# EAGLE board arca-2.0 (EAGLE 9.6.2)
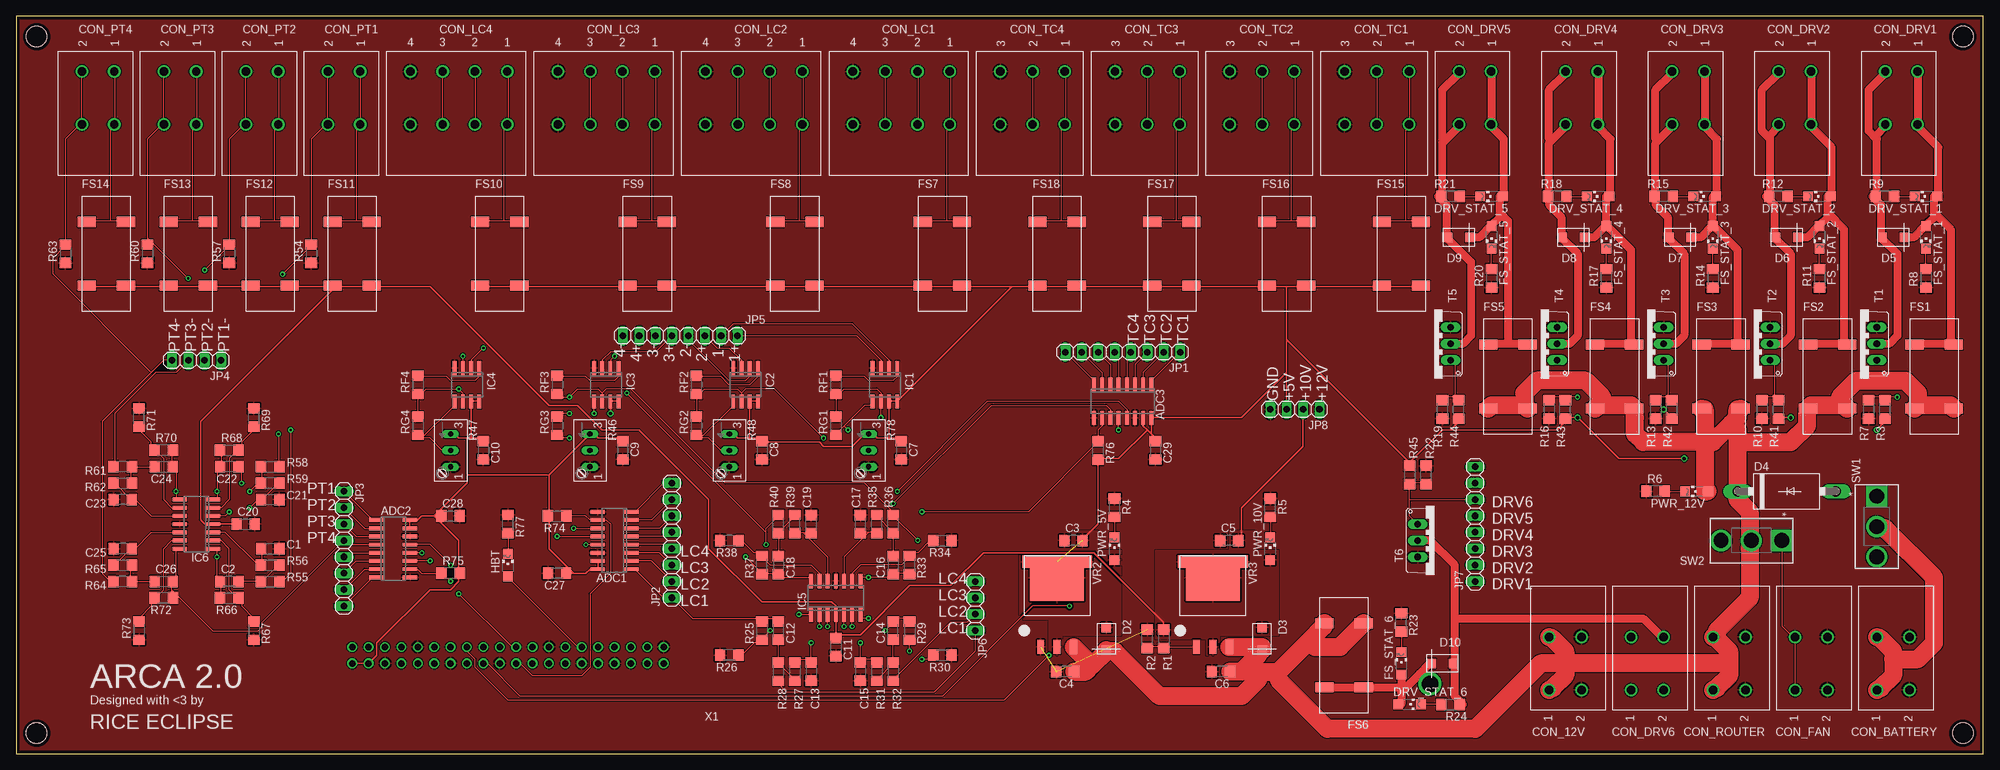
[diagram p8: board, top side]
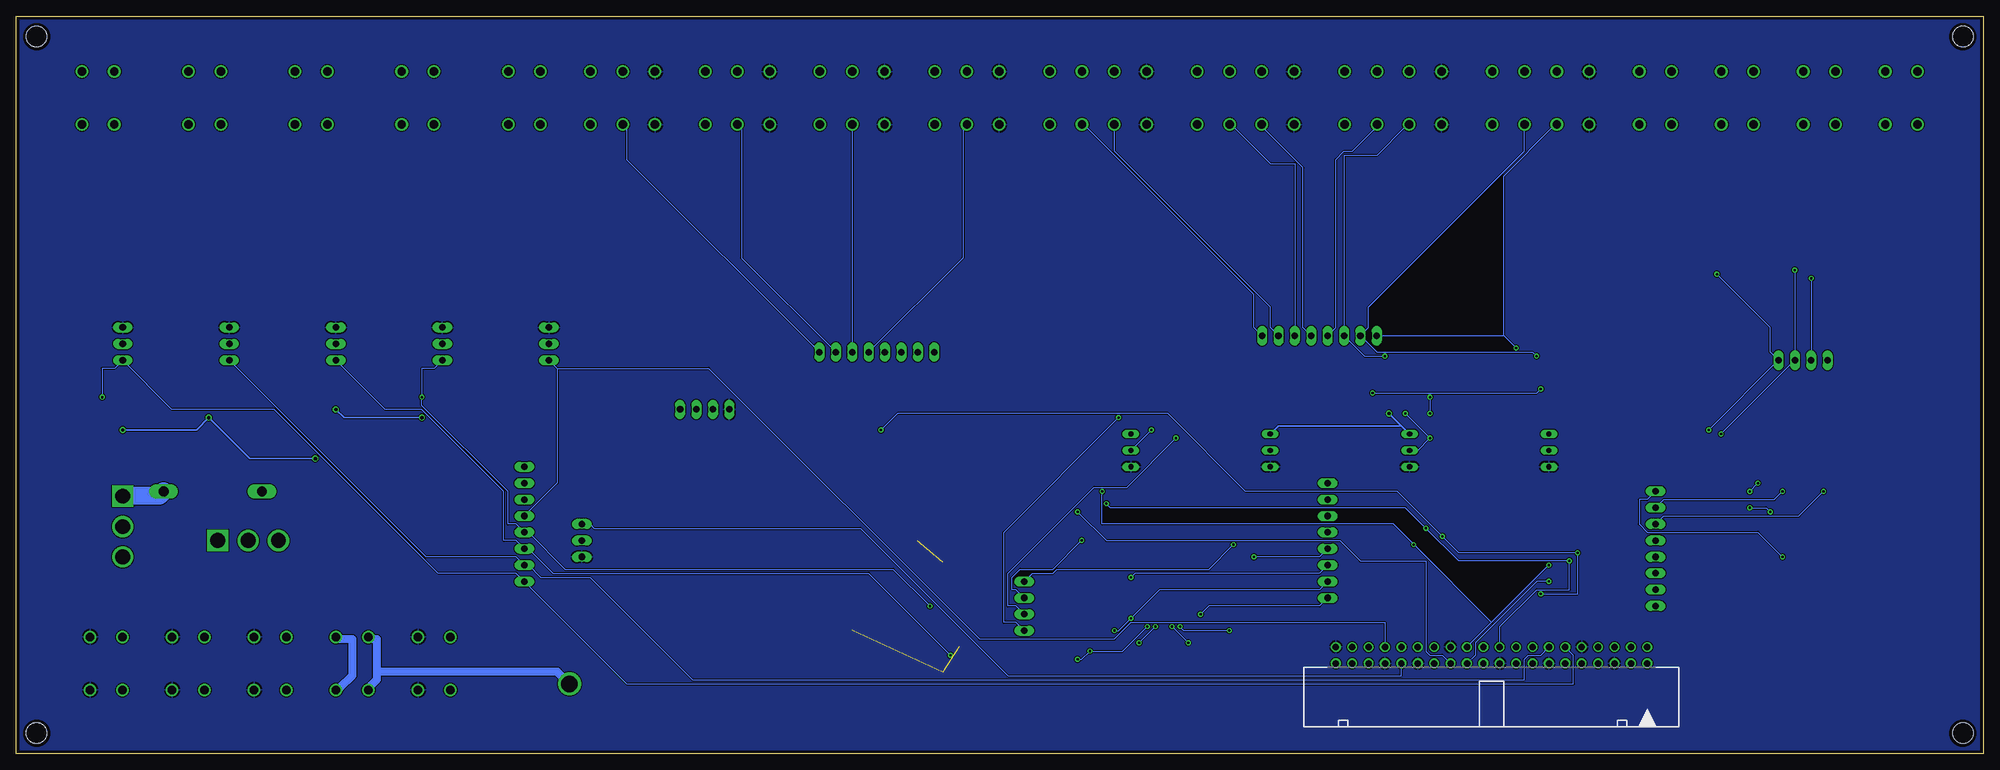
[diagram p9: board, bottom side, seen from below]

Size 304.8 x 114.3 mm. Coordinates in mm from the lower left corner, seen from the top.
Outline: 0,0 304.8,0 304.8,114.3 0,114.3 0,0
Copper layers (1*16): Top 0.035mm / dielectric 1.5mm / Bottom 0.035mm
Design rules "default *": minimum track width 6mil, minimum drill 0.35mm, track to track 6mil, track to pad 6mil, pad to pad 6mil, via to via 6mil, smd to smd 6mil, copper to edge 20mil, drill to drill 6mil, minimum pad ring 10mil, minimum via ring 8mil, stop-mask expansion 4mil, vias tented up to drill 0mil, thermal gap 10mil
Net classes: 1 12V: width 2.794 mm, drill 5.08 mm, clearance 0.508 mm; 2 Driver: width 1.27 mm, drill 2.54 mm, clearance 0.254 mm; 3 5V: width 0.254 mm, drill 0.508 mm, clearance 0.254 mm; 5 10V: width 0.254 mm, drill 0.508 mm, clearance 0.254 mm
Holes 3.17 mm at 3.17,3.17 301.62,3.17 301.62,111.12 3.17,111.12

## Footprints (pad centres in the part's own frame; a part is rotated, then mirrored left to right if it is on the bottom)
SO-16 = smd 0.6 x 2.2: 1 -4.445,-2.6; 2 -3.175,-2.6; 3 -1.905,-2.6; 4 -0.635,-2.6; 5 0.635,-2.6; 6 1.905,-2.6; 7 3.175,-2.6; 8 4.445,-2.6; 9 4.445,2.6; 10 3.175,2.6; 11 1.905,2.6; 12 0.635,2.6; 13 -0.635,2.6; 14 -1.905,2.6; 15 -3.175,2.6; 16 -4.445,2.6
C1206 = smd 1.6 x 1.8: 1 -1.4,0; 2 1.4,0
8.2X2 = drill 1.3: 1 -4.1,2.5; 2 4.1,2.5; 3 -4.1,-2.5; 4 4.1,-2.5
8.2X4 = drill 1.3: 1 -4.1,7.5; 2 4.1,7.5; 3 -4.1,2.5; 4 4.1,2.5; 5 -4.1,-2.5; 6 4.1,-2.5; 7 -4.1,-7.5; 8 4.1,-7.5
8.2X3 = drill 1.3: 1 -4.1,5; 2 4.1,5; 3 -4.1,0; 4 4.1,0; 5 -4.1,-5; 6 4.1,-5
SS* = smd 1.5 x 1.5: P$1 1.75,0; P$2 -1.75,0
DO201-15 = drill 1.499 long: A 7.62,0; C -7.62,0
CHIPLED_1206 = smd 1.5 x 1.5: A 0,-1.75; C 0,1.75
3588-20 = smd 1.575 x 2.819: P$1 -4.953,3.035; P$2 -4.953,-3.035; P$3 4.953,3.035; P$4 4.953,-3.035
SO-8 = smd 0.6 x 2.2: 1 -1.905,-2.6; 2 -0.635,-2.6; 3 0.635,-2.6; 4 1.905,-2.6; 5 1.905,2.6; 6 0.635,2.6; 7 -0.635,2.6; 8 -1.905,2.6
SO14 = smd 0.6 x 2.2: 1 -3.81,-2.6; 2 -2.54,-2.6; 3 -1.27,-2.6; 4 0,-2.6; 5 1.27,-2.6; 6 2.54,-2.6; 7 3.81,-2.6; 8 3.81,2.6; 9 2.54,2.6; 10 1.27,2.6; 11 0,2.6; 12 -1.27,2.6; 13 -2.54,2.6; 14 -3.81,2.6
1X08 = drill 1.016 long: 1 -8.89,0; 2 -6.35,0; 3 -3.81,0; 4 -1.27,0; 5 1.27,0; 6 3.81,0; 7 6.35,0; 8 8.89,0
1X04 = drill 1.016 long: 1 -3.81,0; 2 -1.27,0; 3 1.27,0; 4 3.81,0
R1206 = smd 1.6 x 1.803: 1 -1.422,0; 2 1.422,0
S64W = drill 0.813 long: A 2.54,1.27; E -2.54,1.27; S 0,1.27
1101M2S3CQE2 = drill 2.286 pad 2.794 square: 1 0,9.398 | drill 2.286 pad 2.794: 2 0,4.699; 3 0,0
TO220V = drill 1.016 long: 1 -2.54,-2.54; 2 0,-2.54; 3 2.54,-2.54
TO-263-3L = smd 2.159 x 1.067: P$1 0,-2.54; P$2 0,0; P$3 0,2.54 | smd 6.985 x 8.331: P$4 -10.681,0 | smd 1.905 x 10.795: P$5 -13.221,0
PAK100/2500-5-40 = drill 1 pad 1.422: 1 -24.13,-1.27; 2 -24.13,1.27; 3 -21.59,-1.27; 4 -21.59,1.27; 5 -19.05,-1.27; 6 -19.05,1.27; 7 -16.51,-1.27; 8 -16.51,1.27; 9 -13.97,-1.27; 10 -13.97,1.27; 11 -11.43,-1.27; 12 -11.43,1.27; 13 -8.89,-1.27; 14 -8.89,1.27; 15 -6.35,-1.27; 16 -6.35,1.27; 17 -3.81,-1.27; 18 -3.81,1.27; 19 -1.27,-1.27; 20 -1.27,1.27; 21 1.27,-1.27; 22 1.27,1.27; 23 3.81,-1.27; 24 3.81,1.27; 25 6.35,-1.27; 26 6.35,1.27; 27 8.89,-1.27; 28 8.89,1.27; 29 11.43,-1.27; 30 11.43,1.27; 31 13.97,-1.27; 32 13.97,1.27; 33 16.51,-1.27; 34 16.51,1.27; 35 19.05,-1.27; 36 19.05,1.27; 37 21.59,-1.27; 38 21.59,1.27; 39 24.13,-1.27; 40 24.13,1.27

## Placement (x,y rotation side)
ADC1  MCP3208SN  [SO-16]  92.71,33.02 90 top
ADC2  MCP3208SN  [SO-16]  58.42,31.75 270 top
ADC3  MCP3208SN  [SO-16]  171.45,54.61 180 top
C1  1n  [C1206]  39.37,31.75 0 top
C2  1n  [C1206]  33.02,26.67 180 top
C3  10u  [C1206]  163.83,33.02 180 top
C4  10u  [C1206]  162.56,12.7 180 top
C5  10u  [C1206]  187.96,33.02 180 top
C6  10u  [C1206]  186.69,12.7 180 top
C7  1u  [C1206]  137.16,46.99 270 top
C8  1u  [C1206]  115.57,46.99 270 top
C9  1u  [C1206]  93.98,46.99 270 top
C10  1u  [C1206]  72.39,46.99 270 top
C11  100n  [C1206]  127,16.51 270 top
C12  1n  [C1206]  118.11,19.05 90 top
C13  1n  [C1206]  123.19,12.7 270 top
C14  1n  [C1206]  135.89,19.05 90 top
C15  1n  [C1206]  130.81,12.7 270 top
C16  1n  [C1206]  135.89,29.21 270 top
C17  1n  [C1206]  130.81,35.56 90 top
C18  1n  [C1206]  118.11,29.21 270 top
C19  1n  [C1206]  123.19,35.56 90 top
C20  100n  [C1206]  35.56,35.56 0 top
C21  1n  [C1206]  39.37,39.37 0 top
C22  1n  [C1206]  33.02,44.45 180 top
C23  1n  [C1206]  16.51,39.37 180 top
C24  1n  [C1206]  22.86,44.45 0 top
C25  1n  [C1206]  16.51,31.75 180 top
C26  1n  [C1206]  22.86,26.67 0 top
C27  100n  [C1206]  83.82,27.94 180 top
C28  100n  [C1206]  67.31,36.83 0 top
C29  100n  [C1206]  176.53,46.99 270 top
CON_12V  LPTA-2POS  [8.2X2]  240.03,13.97 90 top
CON_BATTERY  LPTA-2POS  [8.2X2]  290.83,13.97 90 top
CON_DRV1  LPTA-2POS  [8.2X2]  292.1,101.6 270 top
CON_DRV2  LPTA-2POS  [8.2X2]  275.59,101.6 270 top
CON_DRV3  LPTA-2POS  [8.2X2]  259.08,101.6 270 top
CON_DRV4  LPTA-2POS  [8.2X2]  242.57,101.6 270 top
CON_DRV5  LPTA-2POS  [8.2X2]  226.06,101.6 270 top
CON_DRV6  LPTA-2POS  [8.2X2]  252.73,13.97 90 top
CON_FAN  LPTA-2POS  [8.2X2]  278.13,13.97 90 top
CON_LC1  LPTA-4POS  [8.2X4]  137.16,101.6 270 top
CON_LC2  LPTA-4POS  [8.2X4]  114.3,101.6 270 top
CON_LC3  LPTA-4POS  [8.2X4]  91.44,101.6 270 top
CON_LC4  LPTA-4POS  [8.2X4]  68.58,101.6 270 top
CON_PT1  LPTA-2POS  [8.2X2]  50.8,101.6 270 top
CON_PT2  LPTA-2POS  [8.2X2]  38.1,101.6 270 top
CON_PT3  LPTA-2POS  [8.2X2]  25.4,101.6 270 top
CON_PT4  LPTA-2POS  [8.2X2]  12.7,101.6 270 top
CON_ROUTER  LPTA-2POS  [8.2X2]  265.43,13.97 90 top
CON_TC1  LPTA-3POS  [8.2X3]  210.82,101.6 270 top
CON_TC2  LPTA-3POS  [8.2X3]  193.04,101.6 270 top
CON_TC3  LPTA-3POS  [8.2X3]  175.26,101.6 270 top
CON_TC4  LPTA-3POS  [8.2X3]  157.48,101.6 270 top
D2  SS54  [SS*]  168.91,17.78 270 top
D3  SS54  [SS*]  193.04,17.78 270 top
D4  [DO201-15]  274.32,40.64 0 top
D5  SS54  [SS*]  290.83,80.01 0 top
D6  SS54  [SS*]  274.32,80.01 0 top
D7  SS54  [SS*]  257.81,80.01 0 top
D8  SS54  [SS*]  241.3,80.01 0 top
D9  SS54  [SS*]  223.52,80.01 0 top
D10  SS54  [SS*]  220.98,13.97 180 top
DRV_STAT_1  YLW  [CHIPLED_1206]  295.91,86.36 90 top
DRV_STAT_2  YLW  [CHIPLED_1206]  279.4,86.36 90 top
DRV_STAT_3  YLW  [CHIPLED_1206]  261.62,86.36 90 top
DRV_STAT_4  YLW  [CHIPLED_1206]  245.11,86.36 90 top
DRV_STAT_5  YLW  [CHIPLED_1206]  228.6,86.36 90 top
DRV_STAT_6  YLW  [CHIPLED_1206]  215.9,7.62 270 top
FS1  HOLDER_3588-20  [3588-20]  297.18,58.42 270 top
FS2  HOLDER_3588-20  [3588-20]  280.67,58.42 270 top
FS3  HOLDER_3588-20  [3588-20]  264.16,58.42 270 top
FS4  HOLDER_3588-20  [3588-20]  247.65,58.42 270 top
FS5  HOLDER_3588-20  [3588-20]  231.14,58.42 270 top
FS6  HOLDER_3588-20  [3588-20]  205.74,15.24 90 top
FS7  HOLDER_3588-20  [3588-20]  143.51,77.47 270 top
FS8  HOLDER_3588-20  [3588-20]  120.65,77.47 270 top
FS9  HOLDER_3588-20  [3588-20]  97.79,77.47 270 top
FS10  HOLDER_3588-20  [3588-20]  74.93,77.47 270 top
FS11  HOLDER_3588-20  [3588-20]  52.07,77.47 270 top
FS12  HOLDER_3588-20  [3588-20]  39.37,77.47 270 top
FS13  HOLDER_3588-20  [3588-20]  26.67,77.47 270 top
FS14  HOLDER_3588-20  [3588-20]  13.97,77.47 270 top
FS15  HOLDER_3588-20  [3588-20]  214.63,77.47 270 top
FS16  HOLDER_3588-20  [3588-20]  196.85,77.47 270 top
FS17  HOLDER_3588-20  [3588-20]  179.07,77.47 270 top
FS18  HOLDER_3588-20  [3588-20]  161.29,77.47 270 top
FS_STAT_1  BLU  [CHIPLED_1206]  295.91,80.01 180 top
FS_STAT_2  BLU  [CHIPLED_1206]  279.4,80.01 180 top
FS_STAT_3  BLU  [CHIPLED_1206]  262.89,80.01 180 top
FS_STAT_4  BLU  [CHIPLED_1206]  246.38,80.01 180 top
FS_STAT_5  BLU  [CHIPLED_1206]  228.6,80.01 180 top
FS_STAT_6  BLU  [CHIPLED_1206]  214.63,13.97 0 top
HBT  BLU  [CHIPLED_1206]  76.2,29.21 0 top
IC1  MCP6N11R  [SO-8]  134.62,57.15 180 top
IC2  MCP6N11R  [SO-8]  113.03,57.15 180 top
IC3  MCP6N11R  [SO-8]  91.44,57.15 180 top
IC4  MCP6N11R  [SO-8]  69.85,57.15 180 top
IC5  LM324D  [SO14]  127,24.13 0 top
IC6  LM324D  [SO14]  27.94,35.56 90 top
JP1  [1X08]  171.45,62.23 180 top
JP2  [1X08]  101.6,33.02 90 top
JP3  [1X08]  50.8,31.75 270 top
JP4  [1X04]  27.94,60.96 180 top
JP5  [1X08]  102.87,64.77 180 top
JP6  [1X04]  148.59,22.86 90 top
JP7  [1X08]  226.06,35.56 90 top
JP8  [1X04]  198.12,53.34 180 top
PWR_5V  RED  [CHIPLED_1206]  170.18,31.75 0 top
PWR_10V  RED  [CHIPLED_1206]  194.31,31.75 0 top
PWR_12V  RED  [CHIPLED_1206]  260.35,40.64 90 top
R1  68k  [R1206]  177.8,17.78 90 top
R2  10k  [R1206]  175.26,17.78 270 top
R3  DNP  [R1206]  289.56,53.34 270 top
R4  68  [R1206]  170.18,38.1 270 top
R5  220  [R1206]  194.31,38.1 270 top
R6  300  [R1206]  254,40.64 0 top
R7  10k  [R1206]  287.02,53.34 90 top
R8  220  [R1206]  295.91,73.66 90 top
R9  220  [R1206]  289.56,86.36 0 top
R10  10k  [R1206]  270.51,53.34 90 top
R11  220  [R1206]  279.4,73.66 90 top
R12  220  [R1206]  273.05,86.36 0 top
R13  10k  [R1206]  254,53.34 90 top
R14  220  [R1206]  262.89,73.66 90 top
R15  220  [R1206]  255.27,86.36 0 top
R16  10k  [R1206]  237.49,53.34 90 top
R17  220  [R1206]  246.38,73.66 90 top
R18  220  [R1206]  238.76,86.36 0 top
R19  10k  [R1206]  220.98,53.34 90 top
R20  220  [R1206]  228.6,73.66 90 top
R21  220  [R1206]  222.25,86.36 0 top
R22  10k  [R1206]  218.44,43.18 270 top
R23  220  [R1206]  214.63,20.32 270 top
R24  220  [R1206]  222.25,7.62 180 top
R25  15k  [R1206]  115.57,19.05 90 top
R26  10k  [R1206]  110.49,15.24 0 top
R27  68k  [R1206]  120.65,12.7 90 top
R28  68k  [R1206]  118.11,12.7 90 top
R29  15k  [R1206]  138.43,19.05 90 top
R30  10k  [R1206]  143.51,15.24 180 top
R31  68k  [R1206]  133.35,12.7 90 top
R32  68k  [R1206]  135.89,12.7 90 top
R33  15k  [R1206]  138.43,29.21 270 top
R34  10k  [R1206]  143.51,33.02 180 top
R35  68k  [R1206]  133.35,35.56 270 top
R36  68k  [R1206]  135.89,35.56 270 top
R37  15k  [R1206]  115.57,29.21 270 top
R38  10k  [R1206]  110.49,33.02 0 top
R39  68k  [R1206]  120.65,35.56 270 top
R40  68k  [R1206]  118.11,35.56 270 top
R41  DNP  [R1206]  273.05,53.34 270 top
R42  DNP  [R1206]  256.54,53.34 270 top
R43  DNP  [R1206]  240.03,53.34 270 top
R44  DNP  [R1206]  223.52,53.34 270 top
R45  DNP  [R1206]  215.9,43.18 90 top
R46  [S64W]  87.63,46.99 270 top
R47  [S64W]  66.04,46.99 270 top
R48  [S64W]  109.22,46.99 270 top
R54  22  [R1206]  45.72,77.47 90 top
R55  68k  [R1206]  39.37,26.67 180 top
R56  68k  [R1206]  39.37,29.21 180 top
R57  22  [R1206]  33.02,77.47 90 top
R58  68k  [R1206]  39.37,44.45 180 top
R59  68k  [R1206]  39.37,41.91 0 top
R60  22  [R1206]  20.32,77.47 90 top
R61  68k  [R1206]  16.51,44.45 0 top
R62  68k  [R1206]  16.51,41.91 180 top
R63  22  [R1206]  7.62,77.47 90 top
R64  68k  [R1206]  16.51,26.67 0 top
R65  68k  [R1206]  16.51,29.21 180 top
R66  47k  [R1206]  33.02,24.13 180 top
R67  5.1k  [R1206]  36.83,19.05 90 top
R68  47k  [R1206]  33.02,46.99 180 top
R69  5.1k  [R1206]  36.83,52.07 270 top
R70  47k  [R1206]  22.86,46.99 0 top
R71  5.1k  [R1206]  19.05,52.07 270 top
R72  47k  [R1206]  22.86,24.13 0 top
R73  5.1k  [R1206]  19.05,19.05 90 top
R74  10k  [R1206]  83.82,36.83 180 top
R75  10k  [R1206]  67.31,27.94 0 top
R76  10k  [R1206]  167.64,46.99 270 top
R77  68  [R1206]  76.2,35.56 270 top
R78  30k  [S64W]  130.81,46.99 270 top
RF1  20k  [R1206]  127,57.15 90 top
RF2  20k  [R1206]  105.41,57.15 90 top
RF3  20k  [R1206]  83.82,57.15 90 top
RF4  20k  [R1206]  62.23,57.15 90 top
RG1  200  [R1206]  127,50.8 90 top
RG2  200  [R1206]  105.41,50.8 90 top
RG3  200  [R1206]  83.82,50.8 90 top
RG4  200  [R1206]  62.23,50.8 90 top
SW1  1101M2S3CQE2  [1101M2S3CQE2]  288.29,30.48 0 top
SW2  1101M2S3CQE2  [1101M2S3CQE2]  264.16,33.02 270 top
T1  FQP30N06L  [TO220V]  285.75,63.5 90 top
T2  FQP30N06L  [TO220V]  269.24,63.5 90 top
T3  FQP30N06L  [TO220V]  252.73,63.5 90 top
T4  FQP30N06L  [TO220V]  236.22,63.5 90 top
T5  FQP30N06L  [TO220V]  219.71,63.5 90 top
T6  FQP30N06L  [TO220V]  219.71,33.02 270 top
VR2  +5  [TO-263-3L]  161.29,16.51 270 top
VR3  LM1084-ADJ  [TO-263-3L]  185.42,16.51 270 top
X1  2540-5  [PAK100/2500-5-40]  76.2,15.24 180 bottom

## Tracks (layer width: path | path; a pad name or v marks a point on that pad's centre or on a via)
10V_FB
  Top 0.152: 177.8,16.51 175.26,16.51 R2.2 | 177.8,16.51 VR3.P$1 | 177.8,16.51 R1.1
12V_CON
  Top 2.794: 290.83,14.61 290.83,15.88 288.93,17.78 CON_BATTERY.2 | 290.83,14.61 290.83,12.06 288.93,10.16 CON_BATTERY.1 | 290.83,14.61 294.64,14.61 297.18,17.14 297.18,27.3 289.56,34.92 288.29,34.92 SW1.2
12V_IN
  Bottom 2.794: D4.A 282.57,40.01 288.29,40.01 SW1.1
+5V  (via drill 0.51)  (1 unrouted)
  Top 0.254: v274.95,52.07 273.05,52.07 R41.2 | v288.29,50.16 289.56,51.44 R3.2 | 215.9,45.09 220.98,50.16 222.25,50.16 | 222.25,50.16 223.52,51.44 R44.2 | 222.25,50.16 238.76,50.16 240.03,51.44 R43.2 240.03,52.07 v241.94,52.07 248.28,45.72 v258.44,45.72 | v255.27,53.34 256.54,52.07 R42.2 | 175.26,50.16 174.62,50.8 ADC3.15 | 175.26,50.16 175.9,49.53 | 175.9,49.53 176.53,48.9 C29.1 | 175.26,50.16 170.81,45.72 167.64,45.72 R76.2 167.64,35.56 165.1,33.02 C3.1 | 175.9,49.53 ADC3.16 175.9,52.07 189.87,52.07 196.85,59.05 | FS15.P$3 217.17,72.39 212.09,72.39 FS15.P$4 211.46,72.39 200.03,72.39 FS16.P$3 199.39,72.39 196.85,72.39 | 196.85,72.39 194.31,72.39 FS16.P$4 193.68,72.39 182.25,72.39 FS17.P$3 181.61,72.39 176.53,72.39 FS17.P$4 175.9,72.39 164.47,72.39 FS18.P$3 163.83,72.39 158.75,72.39 FS18.P$4 158.12,72.39 154.31,72.39 | 196.85,72.39 196.85,64.14 | 196.85,64.14 196.85,59.05 | 196.85,59.05 JP8.3 | 196.85,64.14 215.9,45.09 | 215.9,45.09 R45.2 | IC2.8 114.94,54.61 113.67,54.61 IC2.7 113.67,48.9 | 113.67,48.9 111.76,48.9 111.12,49.53 R48.E | 113.67,48.9 115.57,48.9 C8.1 115.57,48.26 124.46,48.26 125.09,47.62 129.54,47.62 131.44,49.53 R78.E 132.72,49.53 133.35,48.9 135.25,48.9 | IC3.8 93.34,54.61 92.08,54.61 IC3.7 v92.08,52.7 | C9.1 93.98,48.9 90.17,48.9 89.53,49.53 R46.E 82.55,43.18 | 86.36,27.94 88.27,27.94 88.9,28.57 ADC1.16 90.17,28.57 90.17,29.84 ADC1.15 | 86.36,27.94 C27.1 | 82.55,36.83 82.55,31.75 86.36,27.94 | 82.55,36.83 82.55,43.18 | 82.55,36.83 R74.2 | IC4.8 71.75,54.61 70.48,54.61 IC4.7 70.48,48.9 | 69.85,48.9 68.58,48.9 67.94,49.53 R47.E | 69.85,48.9 70.48,48.9 | 70.48,48.9 72.39,48.9 C10.1
  Top 0.254: X1.2 X1.4 55.88,15.24 55.88,17.14 64.14,25.4 67.31,25.4 68.58,26.67 68.58,27.94 | 64.77,36.83 62.87,36.83 62.23,36.2 ADC2.16 60.96,36.2 60.96,34.92 ADC2.15 | 64.77,36.83 C28.1 | 68.58,27.94 68.58,33.02 64.77,36.83 | 68.58,27.94 R75.2 | 69.85,43.18 69.85,41.91 64.77,36.83 | 69.85,43.18 69.85,48.9 | 69.85,43.18 82.55,43.18 | FS10.P$4 72.39,72.39 77.47,72.39 FS10.P$3 78.11,72.39 94.61,72.39 FS9.P$4 95.25,72.39 100.33,72.39 FS9.P$3 100.97,72.39 117.47,72.39 FS8.P$4 118.11,72.39 123.19,72.39 FS8.P$3 123.83,72.39 140.34,72.39 FS7.P$4 140.97,72.39 146.05,72.39 FS7.P$3 146.69,72.39 154.31,72.39 | 136.53,54.61 135.25,54.61 IC1.7 135.25,48.9 | 135.25,48.9 137.16,48.9 C7.1 | 154.31,72.39 136.53,54.61 | 136.53,54.61 IC1.8
  Bottom 0.254: v288.29,50.16 276.86,50.16 v274.95,52.07 268.61,45.72 v258.44,45.72 | v255.27,53.34 254,52.07 v241.94,52.07 | R46.E 90.17,50.8 | 90.17,50.8 v92.08,52.7 | R48.E 109.22,50.8 90.17,50.8
  pour Top: 162.05,18.29 171.2,18.29 171.2,31.5 167.64,31.5 167.64,34.54 163.58,34.54 163.58,31.5 155.45,31.5 155.45,20.83 160.02,20.83 160.02,15.24 162.05,15.24
+10V
  Top 0.254: FS14.P$4 11.43,72.39 16.51,72.39 FS14.P$3 17.14,72.39 23.5,72.39 FS13.P$4 24.13,72.39 29.21,72.39 FS13.P$3 29.84,72.39 36.2,72.39 FS12.P$4 36.83,72.39 41.91,72.39 FS12.P$3 42.55,72.39 48.9,72.39 FS11.P$4 49.53,72.39 | C20.1 IC6.4 29.21,35.56 28.57,36.2 28.57,51.44 49.53,72.39 | 49.53,72.39 54.61,72.39 FS11.P$3 55.24,72.39 64.14,72.39 82.55,53.98 87,53.98 90.81,50.16 96.52,50.16 107.31,39.37 107.31,31.75 115.57,23.5 126.36,23.5 127,22.86 IC5.4 127,18.41 | JP8.2 199.39,47.62 189.87,38.1 189.87,33.02 C5.1 | 127,18.41 130.81,18.41 138.43,26.04 144.78,26.04 149.86,31.11 167,31.11 177.8,20.32 R1.2 | 127,18.41 C11.1
  pour Top: 184.4,15.24 184.4,17.78 176.53,17.78 176.53,31.5 187.96,31.5 187.96,34.54 192.02,34.54 192.02,31.5 195.58,31.5 195.58,18.29 186.44,18.29 186.44,15.24
+12V
  Top 2.794: 166.69,13.65 165.74,12.7 C4.1 | 166.69,13.65 168.91,15.88 | 168.91,15.88 D2.P$1 | 166.69,13.65 VR2.P$3 | VR3.P$3 192.41,16.51 | 192.41,16.51 193.04,16.51 D3.P$1 | C6.1 189.87,12.7 190.82,13.65 | 190.82,13.65 192.41,15.24 192.41,16.51 | 195.58,12.7 200.34,17.46 | 200.34,17.46 202.56,19.68 FS6.P$3 | 192.41,12.7 191.77,12.7 190.82,13.65 | 192.41,12.7 195.58,12.7 | FS6.P$4 208.28,19.68 205.1,16.51 201.29,16.51 200.34,17.46 | 168.91,15.88 170.18,15.88 177.16,8.89 189.87,8.89 192.41,11.43 192.41,12.7 | 240.03,13.97 240.03,15.88 238.12,17.78 CON_12V.2 | 240.03,13.97 240.03,12.06 238.12,10.16 CON_12V.1 | 265.43,13.97 265.43,15.88 263.52,17.78 | 265.43,13.97 265.43,12.06 263.52,10.16 CON_ROUTER.1 | 263.52,17.78 CON_ROUTER.2 | 265.43,13.97 240.03,13.97 | 233.68,53.98 228.6,53.98 FS5.P$4 | 233.68,53.98 FS5.P$3 | 245.75,53.98 250.19,53.98 FS4.P$3 250.82,52.07 250.82,49.53 252.09,48.26 261.62,48.26 | 245.75,53.98 245.11,53.98 FS4.P$4 | 233.68,53.98 233.68,55.88 235.59,57.78 243.21,57.78 245.75,55.24 245.75,53.98 | 294.64,53.98 299.72,53.98 FS1.P$3 | 294.64,53.98 FS1.P$4 | 282.57,53.98 283.21,53.98 FS2.P$3 | 282.57,53.98 278.13,53.98 FS2.P$4 277.5,52.07 277.5,50.8 274.95,48.26 266.7,48.26 | 261.62,48.26 261.62,53.34 FS3.P$4 | 261.62,48.26 261.62,40.64 PWR_12V.A | 265.75,51.12 262.89,48.26 261.62,48.26 | 265.75,51.12 266.7,52.07 266.7,53.34 FS3.P$3 | 266.7,48.26 266.7,50.16 265.75,51.12 | 266.7,48.26 D4.C 266.7,39.37 268.61,37.47 268.61,33.02 SW2.2 268.61,31.75 268.61,24.13 263.52,19.05 263.52,17.78 | 294.64,53.98 294.64,55.88 292.74,57.78 285.12,57.78 282.57,55.24 282.57,53.98 | 240.03,13.97 236.22,13.97 226.06,3.81 203.2,3.81 195.58,11.43 195.58,12.7
ADC1_CS
  Top 0.152: R74.1 88.27,36.83 88.9,36.2 ADC1.10 91.44,36.2 92.08,35.56 92.08,27.94 88.9,24.77 88.9,13.34 87.63,12.06 80.01,12.06 78.11,13.97 X1.22
ADC2_CS  (via drill 0.35)
  Top 0.152: ADC2.10 62.23,28.57 62.87,27.94 R75.1 66.04,27.94 v67.31,26.67
  Bottom 0.152: X1.24 78.74,15.24 78.74,17.14 69.22,26.67 v67.31,26.67
ADC3_CS  (via drill 0.35)
  Top 0.152: ADC3.10 168.28,50.8 167.64,50.16 R76.1 167.64,48.26 156.84,37.47 v140.34,37.47
  Bottom 0.152: X1.26 83.82,15.24 85.72,15.24 86.36,15.88 86.36,29.84 96.52,29.84 99.69,33.02 135.89,33.02 v140.34,37.47
DRV_CTL_1  (via drill 0.35)
  Top 0.152: 289.56,55.24 287.02,55.24 R7.2 | v291.46,55.24 289.56,55.24 | 289.56,55.24 R3.1
  Bottom 0.152: v291.46,55.24 291.46,59.69 289.56,59.69 T1.1 280.67,53.34 264.8,53.34 239.4,27.94 227.33,27.94 JP7.1 210.19,10.79 63.5,10.79 63.5,15.24 X1.11
DRV_CTL_2
  Top 0.152: 272.42,55.24 273.05,55.24 R41.1 272.42,55.24 | 272.42,55.24 270.51,55.24 R10.2 | 272.42,55.24 272.42,60.33 T2.1
  Bottom 0.152: X1.13 68.58,15.24 70.48,15.24 71.12,14.61 71.12,11.43 200.03,11.43 215.9,27.3 223.52,27.3 225.43,29.21 JP7.2 227.33,30.48 241.3,30.48 T2.1
DRV_CTL_3  (via drill 0.35)
  Top 0.152: 255.91,55.24 256.54,55.24 R42.1 255.91,55.24 | 255.91,55.24 254,55.24 R13.2 | 255.91,55.24 255.91,60.33 T3.1 | X1.15 69.85,15.88 71.12,14.61 71.12,13.34 76.2,8.26 153.03,8.26 v160.02,15.24
  Bottom 0.152: v160.02,15.24 172.72,27.94 221.62,27.94 225.43,31.75 JP7.3 227.33,33.02 229.24,33.02 229.24,40.64 241.94,53.34 247.65,53.34 T3.1
DRV_CTL_4  (via drill 0.35)
  Top 0.152: 240.03,55.24 237.49,55.24 R16.2 | v241.94,55.24 240.03,55.24 | 240.03,55.24 R43.1 | X1.18 73.03,13.97 78.11,8.89 143.51,8.89 157.48,22.86 v163.19,22.86
  Bottom 0.152: T4.1 240.03,59.69 241.94,59.69 v241.94,55.24 241.94,53.98 228.6,40.64 228.6,35.56 227.33,35.56 JP7.4 225.43,34.29 219.71,28.57 168.91,28.57 v163.19,22.86
DRV_CTL_5
  Top 0.152: 222.88,55.24 223.52,55.24 R44.1 222.88,55.24 | 222.88,55.24 220.98,55.24 R19.2 | 222.88,55.24 222.88,60.33 T5.1
  Bottom 0.152: X1.33 92.71,20.32 132.08,20.32 134.62,17.78 155.57,17.78 197.49,59.69 220.98,59.69 | T5.1 220.98,59.69 | JP7.5 220.98,41.91 220.98,59.69
DRV_CTL_6
  Top 0.152: R22.2 218.44,41.91 215.9,41.91 R45.1 215.9,39.37 | 215.9,39.37 215.9,36.83 T6.1 | 215.9,39.37 JP7.6
  Bottom 0.152: X1.32 90.17,12.06 151.13,12.06 173.99,34.92 215.26,34.92 215.9,35.56 T6.1
DRV_NEG_1
  Top 1.27: 288.93,80.01 288.93,85.09 287.65,86.36 R9.1 288.29,86.36 288.29,95.25 | T1.2 290.19,63.5 291.46,64.77 291.46,77.47 288.93,80.01 | 288.93,80.01 D5.P$2 | 288.29,95.25 288.29,95.89 289.56,97.16 CON_DRV1.4 | 288.29,95.25 287.02,96.52 287.02,102.87 289.56,105.41 CON_DRV1.3
DRV_NEG_2
  Top 1.27: 272.42,80.01 272.42,85.09 271.14,86.36 R12.1 271.78,86.36 271.78,95.25 | T2.2 273.69,63.5 274.95,64.77 274.95,77.47 272.42,80.01 | 272.42,80.01 D6.P$2 | 271.78,95.25 271.78,95.89 273.05,97.16 CON_DRV2.4 | 271.78,95.25 270.51,96.52 270.51,102.87 273.05,105.41 CON_DRV2.3
DRV_NEG_3
  Top 1.27: 255.91,80.01 255.91,83.19 254,85.09 254,86.36 | T3.2 257.18,63.5 258.44,64.77 258.44,77.47 255.91,80.01 | 255.91,80.01 D7.P$2 | 254.32,94.93 254,94.61 254,86.36 | 254.32,94.93 256.54,97.16 CON_DRV3.4 | 254,86.36 R15.1 | CON_DRV3.3 256.54,105.41 254,102.87 254,95.25 254.32,94.93
DRV_NEG_4
  Top 1.27: 239.4,80.01 239.4,83.19 237.49,85.09 237.49,86.36 | T4.2 240.66,63.5 241.94,64.77 241.94,77.47 239.4,80.01 | 239.4,80.01 D8.P$2 | 237.81,94.93 237.49,94.61 237.49,86.36 | 237.81,94.93 240.03,97.16 CON_DRV4.4 | 237.49,86.36 R18.1 | CON_DRV4.3 240.03,105.41 237.49,102.87 237.49,95.25 237.81,94.93
DRV_NEG_5
  Top 1.27: 221.62,80.01 221.62,85.09 220.34,86.36 R21.1 220.98,86.36 220.98,94.61 221.3,94.93 | T5.2 224.16,63.5 225.43,64.77 225.43,76.2 221.62,80.01 | 221.62,80.01 D9.P$2 | 221.3,94.93 223.52,97.16 CON_DRV5.4 | CON_DRV5.3 223.52,105.41 220.98,102.87 220.98,95.25 221.3,94.93
DRV_NEG_6
  Top 1.27: 222.88,13.97 222.88,8.89 224.16,7.62 R24.1 | T6.2 219.07,33.02 222.88,29.21 222.88,20.95 | 222.88,13.97 222.88,20.95 | 222.88,13.97 D10.P$2 | 222.88,20.95 252.09,20.95 254.63,18.41 CON_DRV6.4
  Bottom 1.27: CON_DRV6.3 254.63,10.16 252.73,12.06 252.73,17.78 254.63,17.78 CON_DRV6.4
DRV_POS_1
  Top 1.27: CON_DRV1.1 294.64,105.41 294.64,97.79 CON_DRV1.2 294.64,97.16 297.81,93.98 297.81,86.36 DRV_STAT_1.A 297.18,86.36 297.18,83.82 | FS1.P$2 294.64,63.5 299.72,63.5 FS1.P$1 299.72,64.14 299.72,81.28 297.18,83.82 | D5.P$1 294,80.01 295.91,81.92 | 297.18,83.82 297.18,83.19 295.91,81.92 | 295.91,81.92 FS_STAT_1.A
DRV_POS_2
  Top 1.27: CON_DRV2.1 278.13,105.41 278.13,97.79 CON_DRV2.2 278.13,97.16 281.31,93.98 281.31,86.36 DRV_STAT_2.A 280.67,86.36 280.67,83.82 | FS2.P$2 278.13,63.5 283.21,63.5 FS2.P$1 283.21,64.14 283.21,81.28 280.67,83.82 | D6.P$1 277.5,80.01 279.4,81.92 | 280.67,83.82 280.67,83.19 279.4,81.92 | 279.4,81.92 FS_STAT_2.A
DRV_POS_3
  Top 1.27: CON_DRV3.1 261.62,105.41 261.62,97.79 CON_DRV3.2 261.62,97.16 263.52,95.25 263.52,86.36 DRV_STAT_3.A 262.89,86.36 262.89,81.92 | FS3.P$2 261.62,63.5 266.7,63.5 FS3.P$1 266.7,64.14 266.7,78.11 262.89,81.92 | D7.P$1 260.99,80.01 262.89,81.92 | 262.89,81.92 FS_STAT_3.A
DRV_POS_4
  Top 1.27: CON_DRV4.1 245.11,105.41 245.11,97.79 CON_DRV4.2 245.11,97.16 247.01,95.25 247.01,86.36 DRV_STAT_4.A 246.38,86.36 246.38,81.92 | FS4.P$2 245.11,63.5 250.19,63.5 FS4.P$1 250.19,64.14 250.19,78.11 246.38,81.92 | D8.P$1 244.47,80.01 246.38,81.92 | 246.38,81.92 FS_STAT_4.A
DRV_POS_5
  Top 1.27: CON_DRV5.1 228.6,105.41 228.6,97.79 CON_DRV5.2 228.6,97.16 230.5,95.25 230.5,86.36 DRV_STAT_5.A 229.87,86.36 229.87,83.82 | 231.14,63.5 233.68,63.5 FS5.P$1 | 231.14,63.5 228.6,63.5 FS5.P$2 | D9.P$1 226.69,80.01 228.6,81.92 | 229.87,83.82 229.87,83.19 228.6,81.92 | 228.6,81.92 FS_STAT_5.A | 231.14,63.5 231.14,82.55 229.87,83.82
DRV_POS_6  (via drill 2.54)
  Top 1.27: FS6.P$1 203.2,10.16 208.28,10.16 FS6.P$2 208.91,10.16 214.63,10.16 | FS_STAT_6.A 214.63,10.16 | 214.63,10.16 214.63,9.53 | 214.63,9.53 214.63,7.62 DRV_STAT_6.A | 214.63,9.53 217.49,12.38 | 217.49,12.38 219.07,13.97 D10.P$1 | 217.49,12.38 v219.07,10.79
  Bottom 1.27: 248.92,12.7 248.92,17.78 250.19,17.78 CON_DRV6.2 | 248.92,12.7 248.92,11.43 250.19,10.16 CON_DRV6.1 | 248.92,12.7 220.98,12.7 v219.07,10.79
GND  (2 unrouted)
  pour Top (rank 2): -10.16,133.35 354.58,133.35 354.58,-11.43 -10.16,-11.43
  pour Bottom: -15.24,139.19 361.19,139.19 361.19,-17.78 -15.24,-17.78
HBT
  Top 0.152: X1.29 87,16.51 76.2,27.3 HBT.A
LC1+
  Top 0.152: CON_LC1.4 139.7,97.79 139.7,105.41 CON_LC1.3 | IC1.3 133.99,60.96 130.18,64.77 JP5.1
  Bottom 0.152: JP5.1 113.03,66.04 113.03,71.12 139.06,97.16 CON_LC1.4
LC1-
  Top 0.152: CON_LC1.6 134.62,97.79 134.62,105.41 CON_LC1.5 | IC1.2 135.25,60.96 129.54,66.67 111.12,66.67 JP5.2
  Bottom 0.152: JP5.2 110.49,66.04 110.49,69.22 134.62,93.34 134.62,97.16 CON_LC1.6
LC1_CAL  (via drill 0.35)
  Top 0.152: 115.57,20.95 118.11,20.95 C12.2 | ADC1.1 95.89,28.57 100.33,24.13 JP2.1 104.78,20.95 115.57,20.95 | v121.28,21.59 123.19,21.59 IC5.1 | 115.57,20.95 R25.2
  Bottom 0.152: v121.28,21.59 120.02,22.86 102.87,22.86 JP2.1
LC1_PREC  (via drill 0.35)
  Top 0.152: 127,55.24 RG1.2 | 127,55.24 128.27,56.52 133.35,56.52 133.99,55.88 IC1.6 v133.99,52.07 | 127,55.24 RF1.1 | JP6.1 148.59,15.88 142.24,9.53 119.38,9.53 118.11,10.79 R28.1
  Bottom 0.152: v133.99,52.07 151.76,34.29 151.76,20.32 149.86,20.32 JP6.1
LC2+
  Top 0.152: IC2.3 112.39,60.96 110.49,62.87 108.58,62.87 JP5.3 | CON_LC2.4 116.84,97.79 116.84,105.41 CON_LC2.3
  Bottom 0.152: JP5.3 106.68,91.44 110.49,91.44 116.2,97.16 CON_LC2.4
LC2-
  Top 0.152: CON_LC2.6 111.76,97.79 111.76,105.41 CON_LC2.5 | IC2.2 113.67,58.42 113.03,57.78 110.49,57.78 104.14,64.14 JP5.4
  Bottom 0.152: JP5.4 105.41,66.04 105.41,90.81 111.76,97.16 CON_LC2.6
LC2_CAL  (via drill 0.35)
  Top 0.152: R29.2 138.43,20.95 135.89,20.95 C14.2 135.89,20.32 v134.62,19.05 | v132.08,20.95 130.81,20.95 IC5.7 | ADC1.2 98.42,29.84 JP2.2
  Bottom 0.152: v134.62,19.05 133.99,19.05 v132.08,20.95 127.64,25.4 102.87,25.4 JP2.2
LC2_PREC  (via drill 0.35)
  Top 0.152: 105.41,55.24 RG2.2 | 112.39,55.88 IC2.6 | 112.39,55.88 111.76,56.52 106.68,56.52 105.41,55.24 | 105.41,55.24 RF2.1 | JP6.2 147.32,20.32 144.78,20.32 135.89,11.43 R32.1 | 112.39,55.88 113.03,56.52 117.47,56.52 v125.09,48.9
  Bottom 0.152: v125.09,48.9 132.72,41.27 137.79,41.27 151.13,27.94 151.13,22.86 149.86,22.86 JP6.2
LC3+
  Top 0.152: CON_LC3.4 93.98,97.79 93.98,105.41 CON_LC3.3 | IC3.3 90.81,60.96 92.08,62.23 99.06,62.23 JP5.5
  Bottom 0.152: JP5.5 100.33,66.04 100.33,92.08 99.06,93.34 97.79,93.34 93.98,97.16 CON_LC3.4
LC3-  (via drill 0.35)
  Top 0.152: IC3.2 92.08,60.96 v92.71,61.59 | CON_LC3.6 88.9,97.79 88.9,105.41 CON_LC3.5
  Bottom 0.152: v92.71,61.59 95.89,61.59 JP5.6 99.06,92.71 93.98,92.71 89.53,97.16 CON_LC3.6
LC3_CAL  (via drill 0.35)
  Top 0.152: R33.2 138.43,27.94 135.89,27.94 C16.2 135.89,27.3 v132.08,27.3 130.81,27.3 IC5.8 | ADC1.3 99.69,31.11 JP2.3
  Bottom 0.152: v132.08,27.3 131.44,27.94 102.87,27.94 JP2.3
LC3_PREC  (via drill 0.35)
  Top 0.152: v85.72,52.7 83.82,52.7 RG3.2 | RF3.1 83.82,55.24 v85.72,55.24 87,56.52 90.17,56.52 90.81,55.88 | 90.81,55.88 IC3.6 | v139.7,33.02 135.89,36.83 R36.1 135.89,37.47 131.44,41.91 109.86,41.91 95.25,56.52 91.44,56.52 90.81,55.88
  Bottom 0.152: v85.72,55.24 v85.72,52.7 | v139.7,33.02 144.15,28.57 149.22,28.57 150.5,27.3 150.5,25.4 149.86,25.4 JP6.3
LC4+  (via drill 0.35)
  Top 0.152: CON_LC4.4 71.12,97.79 71.12,105.41 CON_LC4.3 | v69.22,61.59 IC4.3
  Bottom 0.152: v69.22,61.59 69.85,62.23 93.98,62.23 JP5.7 95.25,66.04 95.25,69.22 71.12,93.34 71.12,97.16 CON_LC4.4
LC4-  (via drill 0.35)
  Top 0.152: CON_LC4.6 66.04,97.79 66.04,105.41 CON_LC4.5 | IC4.2 70.48,60.96 v72.39,62.87
  Bottom 0.152: 74.3,64.77 v72.39,62.87 | JP5.8 74.3,64.77 | 74.3,64.77 74.3,89.53 66.67,97.16 CON_LC4.6
LC4_CAL  (via drill 0.35)
  Top 0.152: 115.57,27.94 118.11,27.94 C18.2 118.11,27.3 123.19,27.3 IC5.14 | ADC1.4 100.97,32.38 JP2.4 | v113.03,30.48 115.57,27.94 | 115.57,27.94 R37.2
  Bottom 0.152: v113.03,30.48 102.87,30.48 JP2.4
LC4_PREC  (via drill 0.35)
  Top 0.152: 62.23,55.24 RG4.2 | IC4.6 69.22,55.88 v68.58,56.52 63.5,56.52 62.23,55.24 | 62.23,55.24 RF4.1 | v116.2,32.38 116.2,34.29 | 116.2,34.29 116.2,34.92 118.11,36.83 R40.1 | 116.2,34.29 v94.61,55.88
  Bottom 0.152: v116.2,32.38 120.02,28.57 143.51,28.57 144.15,27.94 147.32,27.94 JP6.4 | v68.58,56.52 69.22,55.88 v94.61,55.88
N$1
  Top 0.152: R11.2 FS_STAT_2.C
N$2  (via drill 0.35)
  Top 0.152: 128.27,50.8 131.44,53.98 132.72,53.98 IC1.5 | 128.27,50.8 127,49.53 RG1.1 | 128.27,50.8 v128.91,50.16
  Bottom 0.152: v128.91,50.16 R78.S
N$3
  Top 0.152: R4.2 PWR_5V.C
N$4
  Top 0.152: R5.2 PWR_10V.C
N$5
  Top 0.152: R6.2 PWR_12V.C
N$6
  Top 0.152: R12.2 DRV_STAT_2.C
N$7
  Top 0.152: R14.2 FS_STAT_3.C
N$8
  Top 0.152: R8.2 FS_STAT_1.C
N$9
  Top 0.152: R9.2 DRV_STAT_1.C
N$10
  Top 0.152: R15.2 DRV_STAT_3.C
N$11
  Top 0.152: R17.2 FS_STAT_4.C
N$12
  Top 0.152: R18.2 DRV_STAT_4.C
N$13
  Top 0.152: R20.2 FS_STAT_5.C
N$14
  Top 0.152: R21.2 DRV_STAT_5.C
N$15
  Top 0.152: R23.2 FS_STAT_6.C
N$16
  Top 0.152: R24.2 DRV_STAT_6.C
N$17
  Top 0.152: 106.05,48.9 107.31,48.9 109.22,46.99 R48.S | 106.05,48.9 105.41,48.9 RG2.1 106.05,48.9 | 106.05,48.9 111.12,53.98 IC2.5
N$18
  Top 0.152: IC1.1 136.53,58.42 135.89,57.78 132.08,57.78 131.44,58.42 127,58.42 RF1.2
N$19
  Top 0.152: R34.2 141.6,33.02 139.7,31.11 138.43,31.11 R33.1 138.43,30.48 137.16,29.21 130.81,29.21 129.54,27.94 IC5.9
N$20
  Top 0.152: 132.08,34.29 133.35,34.29 R35.2 | 132.08,34.29 130.81,34.29 C17.1 | IC5.10 128.27,30.48 132.08,34.29
N$21
  Top 0.152: IC2.1 114.94,58.42 113.67,57.15 110.49,57.15 109.22,58.42 105.41,58.42 RF2.2
N$22  (via drill 0.35)
  Top 0.152: v34.92,41.91 34.92,44.45 C22.1 | v36.2,40.64 37.47,41.91 R59.1 38.1,41.91 38.1,44.45 R58.2
  Bottom 0.152: v36.2,40.64 v34.92,41.91
N$23
  Top 0.152: C16.1 R36.2 135.89,34.29 133.35,36.83 R35.1
N$24
  Top 0.152: IC3.1 93.34,58.42 92.71,57.78 88.9,57.78 88.27,58.42 83.82,58.42 RF3.2
N$25
  Top 0.152: C2.1 R55.2 38.1,26.67 40.64,29.21 R56.1
N$26
  Top 0.152: R38.2 112.39,33.02 114.3,31.11 115.57,31.11 R37.1 115.57,30.48 116.84,29.21 123.19,29.21 124.46,27.94 IC5.13
N$27
  Top 0.152: IC4.1 71.75,58.42 71.12,57.78 67.31,57.78 66.67,58.42 62.23,58.42 RF4.2
N$28
  Top 0.152: 62.87,48.9 64.14,48.9 66.04,46.99 R47.S | 62.87,48.9 62.23,48.9 RG4.1 62.87,48.9 | 62.87,48.9 67.94,53.98 IC4.5
N$29  (via drill 0.35)
  Top 0.152: R26.2 112.39,15.24 114.3,17.14 115.57,17.14 R25.1 115.57,17.78 v116.84,19.05 | v124.46,19.68 IC5.2
  Bottom 0.152: v124.46,19.68 123.83,19.05 v116.84,19.05
N$30  (via drill 0.35)
  Top 0.152: v138.43,15.88 R29.1 | v140.34,14.61 141.6,14.61 142.24,15.24 R30.2 | v129.54,19.68 IC5.6
  Bottom 0.152: v140.34,14.61 139.7,14.61 v138.43,15.88 133.35,15.88 v129.54,19.68
N$31  (via drill 0.35)
  Top 0.152: 123.19,14.61 120.65,14.61 R27.2 | v125.73,19.68 IC5.3 | 123.19,14.61 v123.19,17.14 | 123.19,14.61 C13.1
  Bottom 0.152: v123.19,17.14 v125.73,19.68
N$32
  Top 0.152: C12.1 R28.2 118.11,13.97 120.65,11.43 R27.1
N$33  (via drill 0.35)
  Top 0.152: 130.81,14.61 133.35,14.61 R31.2 | v128.27,19.68 IC5.5 | 130.81,14.61 v130.81,17.14 | 130.81,14.61 C15.1
  Bottom 0.152: v130.81,17.14 v128.27,19.68
N$34
  Top 0.152: C14.1 R32.2 135.89,13.97 133.35,11.43 R31.1
N$35
  Top 0.152: 121.92,34.29 120.65,34.29 R39.2 | 121.92,34.29 123.19,34.29 C19.1 | IC5.12 125.73,30.48 121.92,34.29
N$36
  Top 0.152: C18.1 R40.2 118.11,34.29 120.65,36.83 R39.1
N$37  (via drill 0.35)
  Top 0.152: v85.72,48.9 83.82,48.9 RG3.1 | v89.53,52.7 IC3.5
  Bottom 0.152: R46.S 87.63,46.99 v85.72,48.9 v89.53,52.7
N$38
  Top 0.152: C1.1 38.1,31.75 38.1,29.21 R56.2 37.47,29.21 32.38,34.29 IC6.3
N$39  (via drill 0.35)
  Top 0.152: R59.2 40.64,41.91 38.1,39.37 C21.1 37.47,39.37 v36.2,38.1 | IC6.5 32.38,36.83 v33.02,37.47
  Bottom 0.152: v33.02,37.47 33.66,38.1 v36.2,38.1
N$40
  Top 0.152: C24.1 R61.2 17.78,44.45 17.78,41.91 R62.1
N$41
  Top 0.152: R62.2 15.24,41.91 17.78,39.37 C23.1 18.41,39.37 20.95,36.83 IC6.10
N$42
  Top 0.152: C26.1 R64.2 17.78,26.67 17.78,29.21 R65.1
N$43
  Top 0.152: R65.2 15.24,29.21 17.78,31.75 C25.1 18.41,31.75 20.95,34.29 IC6.12
N$44
  Top 0.152: R73.2 19.05,20.95 20.95,22.86 20.95,24.13 R72.1 21.59,24.13 22.86,25.4 22.86,31.75 24.13,33.02 IC6.13
N$45
  Top 0.152: R71.2 19.05,50.16 20.95,48.26 20.95,46.99 R70.1 21.59,46.99 22.86,45.72 22.86,39.37 24.13,38.1 IC6.9
N$46
  Top 0.152: R69.2 36.83,50.16 34.92,48.26 34.92,46.99 R68.1 34.29,46.99 33.02,45.72 33.02,39.37 31.75,38.1 IC6.6
N$47
  Top 0.152: R67.2 36.83,20.95 34.92,22.86 34.92,24.13 R66.1 34.29,24.13 33.02,25.4 33.02,31.75 31.75,33.02 IC6.2
N$48
  Top 0.152: 275.59,17.78 275.59,10.16 CON_FAN.1 | 275.59,17.78 273.69,19.68 273.69,33.02 SW2.1 | 275.59,17.78 CON_FAN.2
N$49
  Top 0.152: ADC3.5 170.81,61.59 JP1.5
N$50
  Top 0.152: ADC3.6 169.54,60.33 JP1.6
N$51
  Top 0.152: ADC3.7 168.28,59.05 JP1.7
N$52
  Top 0.152: JP1.8 167,57.78 ADC3.8
N$53
  Top 0.152: JP2.8 100.33,41.91 95.89,37.47 ADC1.8
N$54
  Top 0.152: ADC1.7 98.42,36.2 JP2.7
N$55
  Top 0.152: ADC1.6 99.69,34.92 JP2.6
N$56
  Top 0.152: ADC1.5 100.97,33.66 JP2.5
N$57
  Top 0.152: ADC2.5 51.44,31.11 JP3.5
N$58
  Top 0.152: ADC2.6 52.7,29.84 JP3.6
N$59
  Top 0.152: ADC2.7 53.98,28.57 JP3.7
N$60
  Top 0.152: JP3.8 55.24,27.3 ADC2.8
N$61
  Top 0.152: 144.15,82.55 146.05,82.55 FS7.P$1 | 144.15,82.55 140.97,82.55 FS7.P$2 | CON_LC1.1 144.78,105.41 144.78,97.79 CON_LC1.2 144.15,97.16 144.15,82.55
N$62
  Top 0.152: 121.28,82.55 123.19,82.55 FS8.P$1 | 121.28,82.55 118.11,82.55 FS8.P$2 | CON_LC2.1 121.92,105.41 121.92,97.79 CON_LC2.2 121.28,97.16 121.28,82.55
N$63
  Top 0.152: 98.42,82.55 100.33,82.55 FS9.P$1 | 98.42,82.55 95.25,82.55 FS9.P$2 | CON_LC3.1 99.06,105.41 99.06,97.79 CON_LC3.2 98.42,97.16 98.42,82.55
N$64
  Top 0.152: 75.56,82.55 77.47,82.55 FS10.P$1 | 75.56,82.55 72.39,82.55 FS10.P$2 | CON_LC4.1 76.2,105.41 76.2,97.79 CON_LC4.2 75.56,97.16 75.56,82.55
N$65
  Top 0.152: 52.7,82.55 54.61,82.55 FS11.P$1 | 52.7,82.55 49.53,82.55 FS11.P$2 | CON_PT1.1 53.34,105.41 53.34,97.79 CON_PT1.2 52.7,97.16 52.7,82.55
N$66
  Top 0.152: 40.01,82.55 41.91,82.55 FS12.P$1 | 40.01,82.55 36.83,82.55 FS12.P$2 | CON_PT2.1 40.64,105.41 40.64,97.79 CON_PT2.2 40.01,97.16 40.01,82.55
N$69
  Top 0.152: 27.3,82.55 29.21,82.55 FS13.P$1 | 27.3,82.55 24.13,82.55 FS13.P$2 | CON_PT3.1 27.94,105.41 27.94,97.79 CON_PT3.2 27.3,97.16 27.3,82.55
N$70
  Top 0.152: 14.61,82.55 16.51,82.55 FS14.P$1 | 14.61,82.55 11.43,82.55 FS14.P$2 | CON_PT4.1 15.24,105.41 15.24,97.79 CON_PT4.2 14.61,97.16 14.61,82.55
N$71
  Top 0.152: 215.26,82.55 217.17,82.55 FS15.P$1 | 215.26,82.55 212.09,82.55 FS15.P$2 | CON_TC1.1 215.9,105.41 215.9,97.79 CON_TC1.2 215.26,97.16 215.26,82.55
N$72
  Top 0.152: 197.49,82.55 199.39,82.55 FS16.P$1 | 197.49,82.55 194.31,82.55 FS16.P$2 | CON_TC2.1 198.12,105.41 198.12,97.79 CON_TC2.2 197.49,97.16 197.49,82.55
N$73
  Top 0.152: 179.71,82.55 181.61,82.55 FS17.P$1 | 179.71,82.55 176.53,82.55 FS17.P$2 | CON_TC3.1 180.34,105.41 180.34,97.79 CON_TC3.2 179.71,97.16 179.71,82.55
N$74
  Top 0.152: 161.93,82.55 163.83,82.55 FS18.P$1 | 161.93,82.55 158.75,82.55 FS18.P$2 | CON_TC4.1 162.56,105.41 162.56,97.79 CON_TC4.2 161.93,97.16 161.93,82.55
N$75
  Top 0.152: R77.2 HBT.C
PT1-  (via drill 0.35)
  Top 0.152: 48.26,97.79 45.72,95.25 R54.2 45.72,78.74 v41.27,74.3 | 48.26,97.79 48.26,105.41 CON_PT1.3 | 48.26,97.79 CON_PT1.4 | v42.55,50.16 42.55,27.94 41.27,26.67 R55.1
  Bottom 0.152: v42.55,50.16 JP4.1 33.02,62.23 33.02,66.04 v41.27,74.3
PT1_CAL  (via drill 0.35)
  Top 0.152: R66.2 31.75,24.13 31.75,26.67 C2.2 31.11,26.67 v31.11,30.48 31.11,31.75 IC6.1 | JP3.1 55.24,36.2 ADC2.1
  Bottom 0.152: v31.11,30.48 34.92,34.29 52.07,34.29 53.34,35.56 53.34,39.37 52.07,39.37 JP3.1
PT2-  (via drill 0.35)
  Top 0.152: v40.64,49.53 40.64,44.45 R58.1 | 35.56,97.79 33.02,95.25 R57.2 33.02,78.74 v29.21,74.93 | 35.56,97.79 35.56,105.41 CON_PT2.3 | 35.56,97.79 CON_PT2.4
  Bottom 0.152: v40.64,49.53 JP4.2 v29.21,74.93
PT2_CAL  (via drill 0.35)
  Top 0.152: R68.2 31.75,46.99 31.75,44.45 C22.2 31.11,44.45 v31.11,40.64 31.11,39.37 IC6.7 | ADC2.2 53.98,34.92 JP3.2
  Bottom 0.152: v31.11,40.64 32.38,39.37 49.53,39.37 JP3.2
PT3-  (via drill 0.35)
  Top 0.152: JP4.3 24.77,59.05 21.59,59.05 15.24,52.7 15.24,44.45 R61.1 | 20.32,80.01 20.32,95.25 22.86,97.79 | 20.32,80.01 R60.2 | 22.86,97.79 22.86,105.41 CON_PT3.3 | 22.86,97.79 CON_PT3.4 | 20.32,80.01 v26.67,73.66
  Bottom 0.152: v26.67,73.66 JP4.3
PT3_CAL  (via drill 0.35)
  Top 0.152: R70.2 24.13,46.99 24.13,44.45 C24.2 24.77,44.45 v24.77,40.64 24.77,39.37 IC6.8 | ADC2.3 52.7,33.66 JP3.3
  Bottom 0.152: v24.77,40.64 28.57,36.83 49.53,36.83 JP3.3
PT4-
  Top 0.152: 10.16,97.79 7.62,95.25 R63.2 7.62,78.74 5.71,76.83 5.71,74.3 20.95,59.05 | 10.16,97.79 10.16,105.41 CON_PT4.3 | 10.16,97.79 CON_PT4.4 | 20.95,59.05 22.86,60.96 JP4.4 | 20.95,59.05 13.34,51.44 13.34,27.94 14.61,26.67 R64.1
PT4_CAL
  Top 0.152: ADC2.4 51.44,32.38 JP3.4 38.1,20.32 38.1,19.68 37.47,19.05 30.48,19.05 24.13,25.4 | 24.13,25.4 24.13,24.13 R72.2 | 24.13,25.4 24.13,26.67 C26.2 24.77,26.67 24.77,31.75 IC6.14
SPI_CLK  (via drill 0.35)
  Top 0.152: ADC2.13 64.14,32.38 v67.31,29.21 | v88.27,32.38 ADC1.13 | ADC3.13 172.09,53.34 170.81,54.61 150.5,54.61 v136.53,40.64
  Bottom 0.152: 76.2,20.32 79.38,17.14 79.38,16.51 X1.23 | 76.2,20.32 v67.31,29.21 | 76.2,20.32 v88.27,32.38 91.44,35.56 136.53,35.56 v136.53,40.64
SPI_MISO  (via drill 0.35)
  Top 0.152: v62.87,31.11 ADC2.12 | v68.58,24.77 76.83,16.51 X1.21 | v83.82,33.66 ADC1.12 | v170.81,50.16 ADC3.12
  Bottom 0.152: v68.58,24.77 62.87,24.77 v62.87,31.11 81.28,31.11 v83.82,33.66 90.81,40.64 114.3,40.64 126.36,52.7 168.28,52.7 v170.81,50.16
SPI_MOSI  (via drill 0.35)
  Top 0.152: v64.14,29.84 ADC2.11 | v86.36,34.92 ADC1.11 | ADC3.11 169.54,53.34 168.91,53.98 151.13,53.98 v135.89,38.73
  Bottom 0.152: X1.19 74.93,19.68 69.22,25.4 64.14,25.4 v64.14,29.84 81.28,29.84 v86.36,34.92 89.53,38.1 135.25,38.1 v135.89,38.73
TC1
  Top 0.152: JP1.1 175.9,57.78 ADC3.1 | CON_TC1.3 CON_TC1.4
  Bottom 0.152: JP1.1 210.19,92.08 210.19,97.16 210.82,97.16 CON_TC1.4
TC2
  Top 0.152: ADC3.2 174.62,59.05 JP1.2 | CON_TC2.3 CON_TC2.4
  Bottom 0.152: JP1.2 192.41,76.83 192.41,97.16 193.04,97.16 CON_TC2.4
TC3
  Top 0.152: ADC3.3 173.35,60.33 JP1.3 | CON_TC3.3 CON_TC3.4
  Bottom 0.152: CON_TC3.4 JP1.3
TC4
  Top 0.152: ADC3.4 172.09,61.59 JP1.4 | CON_TC4.3 CON_TC4.4
  Bottom 0.152: JP1.4 158.12,76.83 158.12,97.16 157.48,97.16 CON_TC4.4

## Text on the board
tNames: 4- / 4+ / 3- / 3+ / 2- / 2+ / 1- / 1+ | TC4 / TC3 / TC2 / TC1 | PT4- / PT3- / PT2- / PT1- | GND / +5V / +10V / +12V | PT1 / PT2 / PT3 / PT4 | LC4 / LC3 / LC2 / LC1 | DRV6 / DRV5 / DRV4 / DRV3 / DRV2 / DRV1 | LC4 / LC3 / LC2 / LC1 | ARCA 2.0 | Designed with <3 by | RICE ECLIPSE